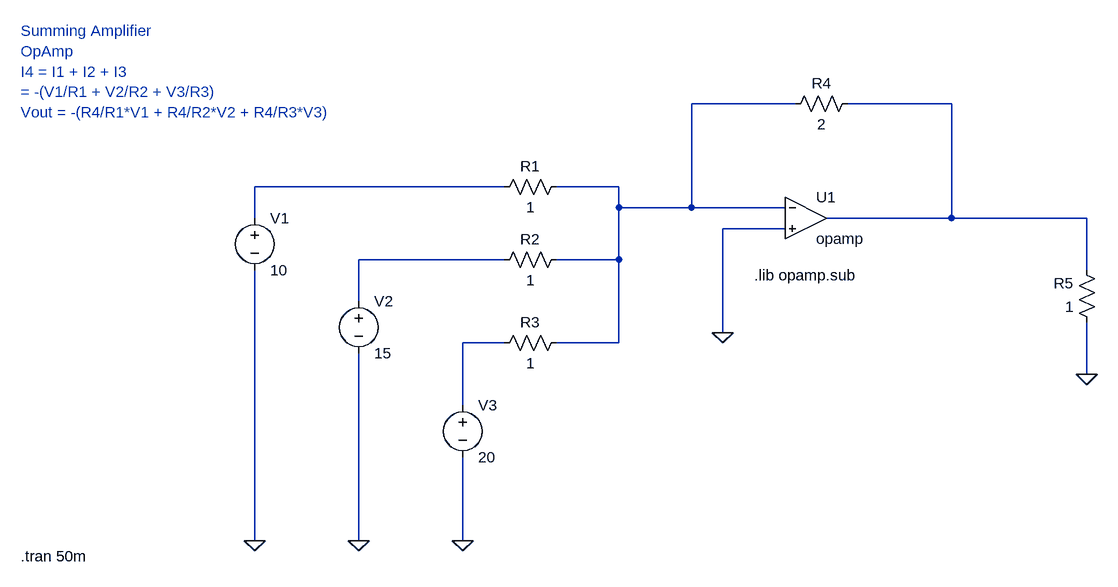
[diagram p0: schematic SummingAmplifire.asc]
SummingAmplifire.asc, the LTspice schematic file:
Version 4.1
SHEET 1 880 680
WIRE 256 -96 96 -96
WIRE 496 -96 336 -96
WIRE -192 32 -576 32
WIRE -16 32 -112 32
WIRE -16 64 -16 32
WIRE 96 64 96 -96
WIRE 96 64 -16 64
WIRE 240 64 96 64
WIRE -576 80 -576 32
WIRE 496 80 496 -96
WIRE 496 80 304 80
WIRE 704 80 496 80
WIRE 240 96 144 96
WIRE -192 144 -416 144
WIRE -16 144 -16 64
WIRE -16 144 -112 144
WIRE 704 160 704 80
WIRE -416 208 -416 144
WIRE 144 256 144 96
WIRE -192 272 -256 272
WIRE -16 272 -16 144
WIRE -16 272 -112 272
WIRE 704 320 704 240
WIRE -256 368 -256 272
WIRE -576 576 -576 160
WIRE -416 576 -416 288
WIRE -256 576 -256 448
FLAG -576 576 0
FLAG -416 576 0
FLAG -256 576 0
FLAG 704 320 0
FLAG 144 256 0
SYMBOL res -96 16 R90
WINDOW 0 0 56 VBottom 2
WINDOW 3 32 56 VTop 2
SYMATTR InstName R1
SYMATTR Value 1
SYMBOL res -96 128 R90
WINDOW 0 0 56 VBottom 2
WINDOW 3 32 56 VTop 2
SYMATTR InstName R2
SYMATTR Value 1
SYMBOL res -96 256 R90
WINDOW 0 0 56 VBottom 2
WINDOW 3 32 56 VTop 2
SYMATTR InstName R3
SYMATTR Value 1
SYMBOL res 352 -112 R90
WINDOW 0 0 56 VBottom 2
WINDOW 3 32 56 VTop 2
SYMATTR InstName R4
SYMATTR Value 2
SYMBOL res 720 256 R180
WINDOW 0 36 76 Left 2
WINDOW 3 36 40 Left 2
SYMATTR InstName R5
SYMATTR Value 1
SYMBOL voltage -576 64 R0
WINDOW 123 0 0 Left 0
WINDOW 39 0 0 Left 0
SYMATTR InstName V1
SYMATTR Value 10
SYMBOL voltage -416 192 R0
WINDOW 123 0 0 Left 0
WINDOW 39 0 0 Left 0
SYMATTR InstName V2
SYMATTR Value 15
SYMBOL voltage -256 352 R0
WINDOW 123 0 0 Left 0
WINDOW 39 0 0 Left 0
SYMATTR InstName V3
SYMATTR Value 20
SYMBOL OpAmps\\opamp 272 16 R0
SYMATTR InstName U1
TEXT -936 -208 Left 2 ;Summing Amplifier\nOpAmp\nI4 = I1 + I2 + I3 \n= -(V1/R1 + V2/R2 + V3/R3)\nVout = -(R4/R1*V1 + R4/R2*V2 + R4/R3*V3)
TEXT 192 168 Left 2 !.lib opamp.sub
TEXT -936 600 Left 2 !.tran 50m

The netlist it stands for:
* SummingAmplifire.asc
R1 N001 N003 1
R2 N001 N004 1
R3 N001 N005 1
R4 N002 N001 2
R5 0 N002 1
V1 N003 0 10
V2 N004 0 15
V3 N005 0 20
X§U1 N001 0 N002 opamp Aol=100K GBW=10Meg  ; pins invin noninvin out
* Summing Amplifier
* OpAmp
* I4 = I1 + I2 + I3
* = -(V1/R1 + V2/R2 + V3/R3)
* Vout = -(R4/R1*V1 + R4/R2*V2 + R4/R3*V3)
.lib opamp.sub
.tran 50m
.backanno
.end